# Altium schematic sheet Arduino FPGA Level Translation.SchDoc
size A4
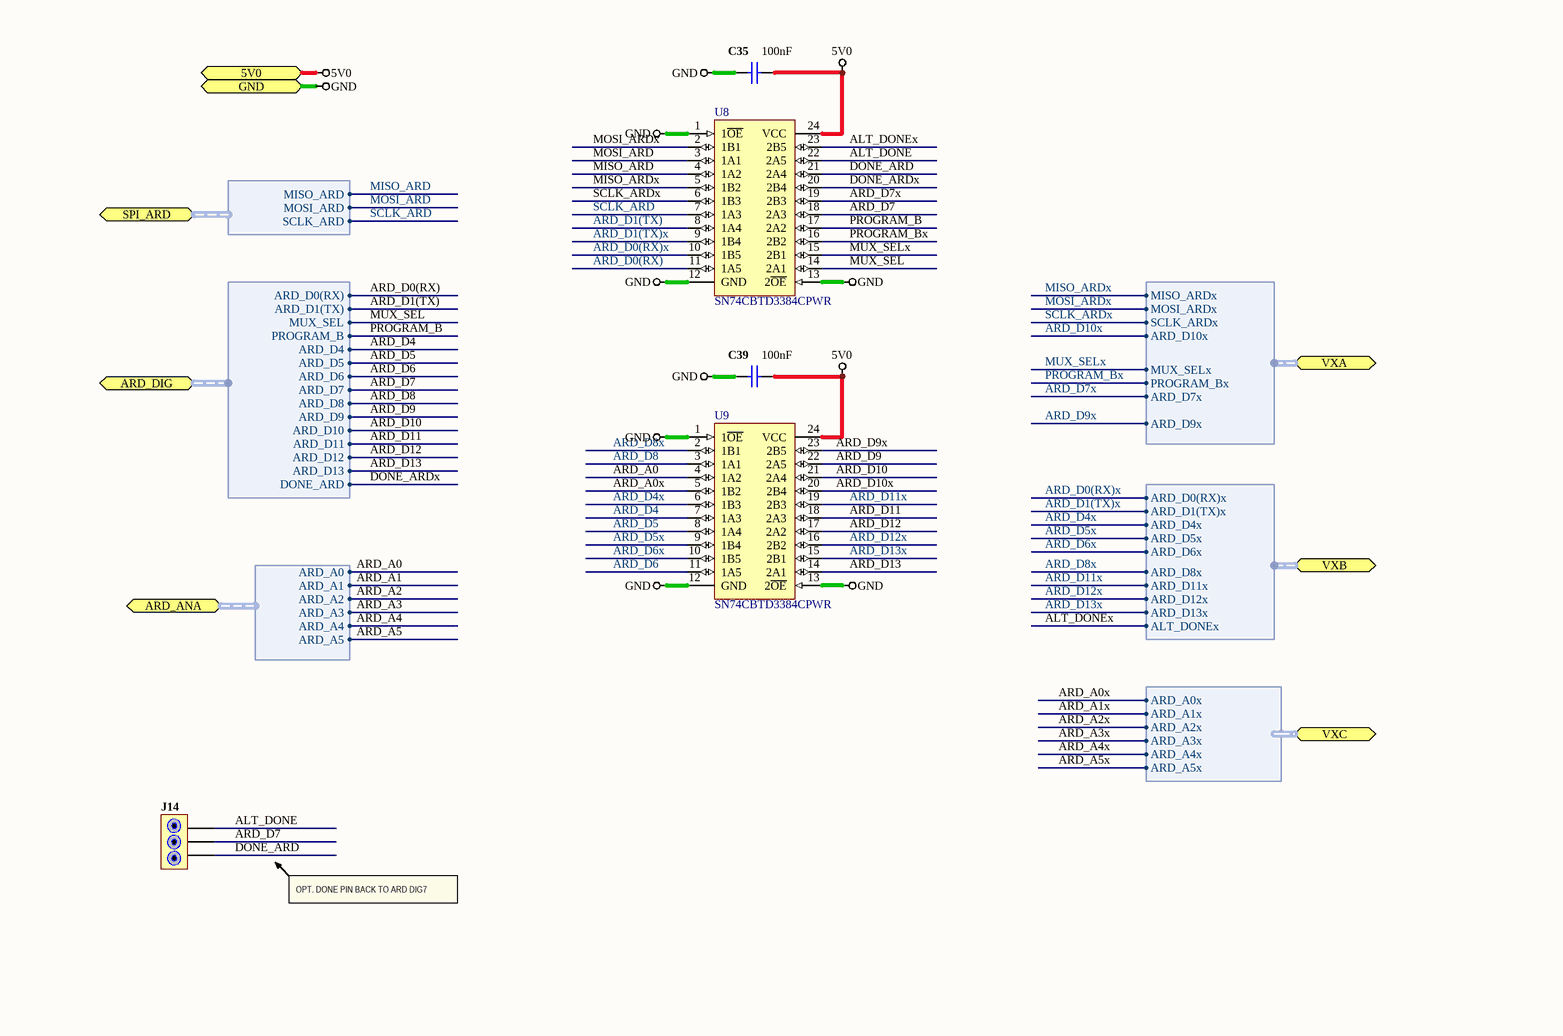
[diagram p0: Arduino FPGA Level Translation.SchDoc]

## Parts
C35  value 100nF  [CAPC0402(1005)60_L]  (hidden comment: CAP 100nF 16V 0402(1005))
C39  value 100nF  [CAPC0402(1005)60_L]  (hidden comment: CAP 100nF 16V 0402(1005))
J14  3-WAY JUMPER  [HDR1X3]  (value not drawn)
U8  SN74CBTD3384CPWR  [TSOP65P620X120-24N]
U9  SN74CBTD3384CPWR  [TSOP65P620X120-24N]

## Ports
5V0, ARD_ANA (harness ARD_ANA), ARD_DIG (harness ARD_DIG), GND, SPI_ARD (harness SPI_ARD), VXA (harness VXA), VXB (harness VXB), VXC (harness VXC)

## Harnesses
SPI_ARD: MISO_ARD, MOSI_ARD, SCLK_ARD
VXB: ARD_D0(RX)x, ARD_D1(TX)x, ARD_D4x, ARD_D5x, ARD_D6x, ARD_D8x, ARD_D11x, ARD_D12x, ARD_D13x, ALT_DONEx
ARD_DIG: ARD_D0(RX), ARD_D1(TX), MUX_SEL, PROGRAM_B, ARD_D4, ARD_D5, ARD_D6, ARD_D7, ARD_D8, ARD_D9, ARD_D10, ARD_D11, ARD_D12, ARD_D13, DONE_ARD
VXA: MISO_ARDx, MOSI_ARDx, SCLK_ARDx, MUX_SELx, PROGRAM_Bx, ARD_D7x, ARD_D10x, ARD_D9x
ARD_ANA: ARD_A0, ARD_A1, ARD_A2, ARD_A3, ARD_A4, ARD_A5
VXC: ARD_A0x, ARD_A1x, ARD_A2x, ARD_A3x, ARD_A4x, ARD_A5x

## Nets
5V0: C35.2 C39.2 U8.24(VCC) U9.24(VCC) ; port 5V0
GND: C35.1 C39.1 U8.1(1~{OE}) U8.12(GND) U8.13(2~{OE}) U9.1(1~{OE}) U9.12(GND) U9.13(2~{OE}) ; port GND
ALT_DONE: J14.3 U8.22(2A5)
ALT_DONEx: U8.23(2B5) ; port VXB.ALT_DONEx
ARD_A0: U9.4(1A2) ; port ARD_ANA.ARD_A0
ARD_A0x: U9.5(1B2) ; port VXC.ARD_A0x
ARD_A1: port ARD_ANA.ARD_A1
ARD_A1x: port VXC.ARD_A1x
ARD_A2: port ARD_ANA.ARD_A2
ARD_A2x: port VXC.ARD_A2x
ARD_A3: port ARD_ANA.ARD_A3
ARD_A3x: port VXC.ARD_A3x
ARD_A4: port ARD_ANA.ARD_A4
ARD_A4x: port VXC.ARD_A4x
ARD_A5: port ARD_ANA.ARD_A5
ARD_A5x: port VXC.ARD_A5x
ARD_D0(RX): U8.11(1A5) ; port ARD_DIG.ARD_D0(RX)
ARD_D0(RX)x: U8.10(1B5) ; port VXB.ARD_D0(RX)x
ARD_D1(TX): U8.8(1A4) ; port ARD_DIG.ARD_D1(TX)
ARD_D1(TX)x: U8.9(1B4) ; port VXB.ARD_D1(TX)x
ARD_D4: U9.7(1A3) ; port ARD_DIG.ARD_D4
ARD_D4x: U9.6(1B3) ; port VXB.ARD_D4x
ARD_D5: U9.8(1A4) ; port ARD_DIG.ARD_D5
ARD_D5x: U9.9(1B4) ; port VXB.ARD_D5x
ARD_D6: U9.11(1A5) ; port ARD_DIG.ARD_D6
ARD_D6x: U9.10(1B5) ; port VXB.ARD_D6x
ARD_D7: J14.2 U8.18(2A3) ; port ARD_DIG.ARD_D7
ARD_D7x: U8.19(2B3) ; port VXA.ARD_D7x
ARD_D8: U9.3(1A1) ; port ARD_DIG.ARD_D8
ARD_D8x: U9.2(1B1) ; port VXB.ARD_D8x
ARD_D9: U9.22(2A5) ; port ARD_DIG.ARD_D9
ARD_D9x: U9.23(2B5) ; port VXA.ARD_D9x
ARD_D10: U9.21(2A4) ; port ARD_DIG.ARD_D10
ARD_D10x: U9.20(2B4) ; port VXA.ARD_D10x
ARD_D11: U9.18(2A3) ; port ARD_DIG.ARD_D11
ARD_D11x: U9.19(2B3) ; port VXB.ARD_D11x
ARD_D12: U9.17(2A2) ; port ARD_DIG.ARD_D12
ARD_D12x: U9.16(2B2) ; port VXB.ARD_D12x
ARD_D13: U9.14(2A1) ; port ARD_DIG.ARD_D13
ARD_D13x: U9.15(2B1) ; port VXB.ARD_D13x
DONE_ARD: J14.1 U8.21(2A4)
DONE_ARDx: U8.20(2B4) ; port ARD_DIG.DONE_ARD
MISO_ARD: U8.4(1A2) ; port SPI_ARD.MISO_ARD
MISO_ARDx: U8.5(1B2) ; port VXA.MISO_ARDx
MOSI_ARD: U8.3(1A1) ; port SPI_ARD.MOSI_ARD
MOSI_ARDx: U8.2(1B1) ; port VXA.MOSI_ARDx
MUX_SEL: U8.14(2A1) ; port ARD_DIG.MUX_SEL
MUX_SELx: U8.15(2B1) ; port VXA.MUX_SELx
PROGRAM_B: U8.17(2A2) ; port ARD_DIG.PROGRAM_B
PROGRAM_Bx: U8.16(2B2) ; port VXA.PROGRAM_Bx
SCLK_ARD: U8.7(1A3) ; port SPI_ARD.SCLK_ARD
SCLK_ARDx: U8.6(1B3) ; port VXA.SCLK_ARDx

## Notes on the sheet
- OPT. DONE PIN BACK TO ARD DIG7

## Library data of the parts
C35 C39 = CAP 100nF 16V ±10% 0402 (1005 Metric) Thickness 0.6mm SMD: Manufacturer_PN: C0402C104K8PACTU; Case-EIA: 0402; Case-Metric: 1005; Tolerance: ±10%; Max Thickness: 0.6 mm; Rated Voltage: 16 V; Technology: SMT; Manufacturer Part Number: C0402C104K8PACTU
J14 = 3-WAY JUMPER: 3-Way Jumper - Center Output; Manufacturer_PN: 71417-103HLF; Manufacturer Part Number: 71417-103HLF
U8 U9 = SN74CBTD3384CPWR: 10-BIT FET BUS SWITCH WITH LEVEL SHIFTING; Manufacturer Part Number: SN74CBTD3861PWR; Manufacturer: Texas Instruments; Circuit: 10 x 1:1; Independent Circuits: 1; Voltage Supply Source: Single Supply; Voltage - Supply: 4.5 V ~ 5.5 V; Category: Integrated Circuits (ICs); Supplier: Digi-Key; RoHS: RoHS Compliant; Packaging: Tape & Reel (TR); Type: FET Bus Switch; Current - Output High, Low: -; Operating Temperature: -40°C ~ 85°C; Mounting Type: Surface Mount; Package / Case: 24-TSSOP (0.173", 4.40mm Width); Supplier Device Package: 24-TSSOP; ComponentLink1URL: http://www.ti.com/lit/ds/symlink/sn74cbtd3861.pdf; ComponentLink1Description: http://www.ti.com/lit/ds/symlink/sn74cbtd3861.pdf; Supplier Part Number: 296-6487-2-ND; Manufacturer_PN: SN74CBTD3861PWR